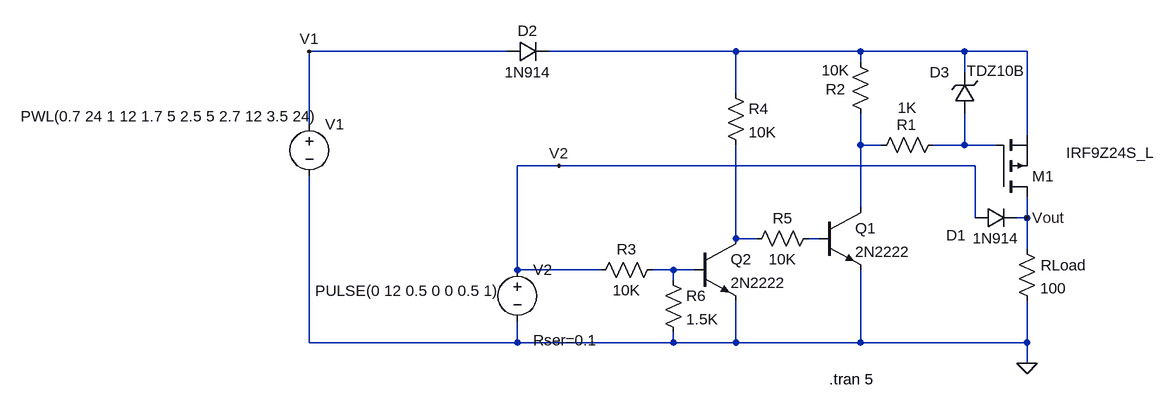
[diagram p0: schematic switch_tension.asc]
switch_tension.asc, the LTspice schematic file:
Version 4
SHEET 1 880 680
WIRE -640 -32 -944 -32
WIRE -288 -32 -576 -32
WIRE -96 -32 -288 -32
WIRE 64 -32 -96 -32
WIRE 160 -32 64 -32
WIRE -96 -16 -96 -32
WIRE 64 0 64 -32
WIRE -288 32 -288 -32
WIRE -944 80 -944 -32
WIRE 160 96 160 -32
WIRE -96 112 -96 64
WIRE -64 112 -96 112
WIRE 64 112 64 64
WIRE 64 112 16 112
WIRE 112 112 64 112
WIRE -560 144 -624 144
WIRE 80 144 -560 144
WIRE -96 208 -96 112
WIRE 80 224 80 144
WIRE 160 224 160 192
WIRE 160 224 144 224
WIRE -288 256 -288 112
WIRE -256 256 -288 256
WIRE -160 256 -176 256
WIRE 160 272 160 224
WIRE -624 304 -624 144
WIRE -496 304 -624 304
WIRE -384 304 -416 304
WIRE -352 304 -384 304
WIRE -384 320 -384 304
WIRE -944 416 -944 160
WIRE -624 416 -624 384
WIRE -624 416 -944 416
WIRE -384 416 -384 400
WIRE -384 416 -624 416
WIRE -288 416 -288 352
WIRE -288 416 -384 416
WIRE -96 416 -96 304
WIRE -96 416 -288 416
WIRE 160 416 160 352
WIRE 160 416 -96 416
WIRE 160 448 160 416
FLAG 160 448 0
FLAG 160 224 Vout
FLAG -944 -32 V1
FLAG -560 144 V2
SYMBOL voltage -944 64 R0
WINDOW 123 0 0 Left 2
WINDOW 3 -444 4 Left 2
SYMATTR Value PWL(0.7 24 1 12 1.7 5 2.5 5 2.7 12 3.5 24)
SYMATTR SpiceLine Rser=0.1
SYMATTR InstName V1
SYMBOL voltage -624 288 R0
WINDOW 3 -311 48 Left 2
WINDOW 123 0 0 Left 2
WINDOW 39 24 124 Left 2
SYMATTR Value PULSE(0 12 0.5 0 0 0.5 1)
SYMATTR SpiceLine Rser=0.1
SYMATTR InstName V2
SYMBOL res 144 256 R0
WINDOW 0 37 41 Left 2
SYMATTR InstName RLoad
SYMATTR Value 100
SYMBOL pmos 112 192 M180
WINDOW 3 108 68 Left 2
SYMATTR Value IRF9Z24S_L
SYMATTR InstName M1
SYMBOL res -400 288 R90
WINDOW 0 0 56 VBottom 2
WINDOW 3 32 56 VTop 2
SYMATTR InstName R3
SYMATTR Value 10K
SYMBOL res -112 -32 R0
WINDOW 0 -38 58 Left 2
WINDOW 3 -44 29 Left 2
SYMATTR InstName R2
SYMATTR Value 10K
SYMBOL diode 80 240 R270
WINDOW 0 -26 -29 VTop 2
WINDOW 3 0 32 VBottom 2
SYMATTR InstName D1
SYMATTR Value 1N914
SYMBOL npn -160 208 R0
SYMATTR InstName Q1
SYMATTR Value 2N2222
SYMBOL npn -352 256 R0
SYMATTR InstName Q2
SYMATTR Value 2N2222
SYMBOL res -160 240 R90
WINDOW 0 0 56 VBottom 2
WINDOW 3 32 56 VTop 2
SYMATTR InstName R5
SYMATTR Value 10K
SYMBOL res -304 16 R0
SYMATTR InstName R4
SYMATTR Value 10K
SYMBOL diode -640 -16 R270
WINDOW 0 32 32 VTop 2
WINDOW 3 0 32 VBottom 2
SYMATTR InstName D2
SYMATTR Value 1N914
SYMBOL res 32 96 R90
WINDOW 0 0 57 VBottom 2
WINDOW 3 -57 56 VTop 2
SYMATTR InstName R1
SYMATTR Value 1K
SYMBOL zener 80 64 R180
WINDOW 0 39 64 Left 2
WINDOW 3 -77 66 Left 2
SYMATTR InstName D3
SYMATTR Value TDZ10B
SYMBOL res -400 304 R0
SYMATTR InstName R6
SYMATTR Value 1.5K
TEXT -144 472 Left 2 !.tran 5

The netlist it stands for:
* switch_tension.asc
V1 V1 0 PWL(0.7 24 1 12 1.7 5 2.5 5 2.7 12 3.5 24) Rser=0.1
V2 V2 0 PULSE(0 12 0.5 0 0 0.5 1) Rser=0.1
RLoad Vout 0 100
M1 Vout N003 N001 N001 IRF9Z24S_L
R3 N006 V2 10K
R2 N001 N002 10K
D1 V2 Vout 1N914
Q1 N002 N005 0 0 2N2222
Q2 N004 N006 0 0 2N2222
R5 N005 N004 10K
R4 N001 N004 10K
D2 V1 N001 1N914
R1 N003 N002 1K
D3 N003 N001 TDZ10B
R6 N006 0 1.5K
.model D D
.lib standard.dio
.model NPN NPN
.model PNP PNP
.lib standard.bjt
.model NMOS NMOS
.model PMOS PMOS
.lib standard.mos
.tran 5
.backanno
.end